# Altium schematic sheet battery_manager_SCH2.SchDoc
size B; Organization: CWRUbotix; Address1: 10900 Euclid Avenue; Address2: Cleveland, OH 44106; Address3: USA
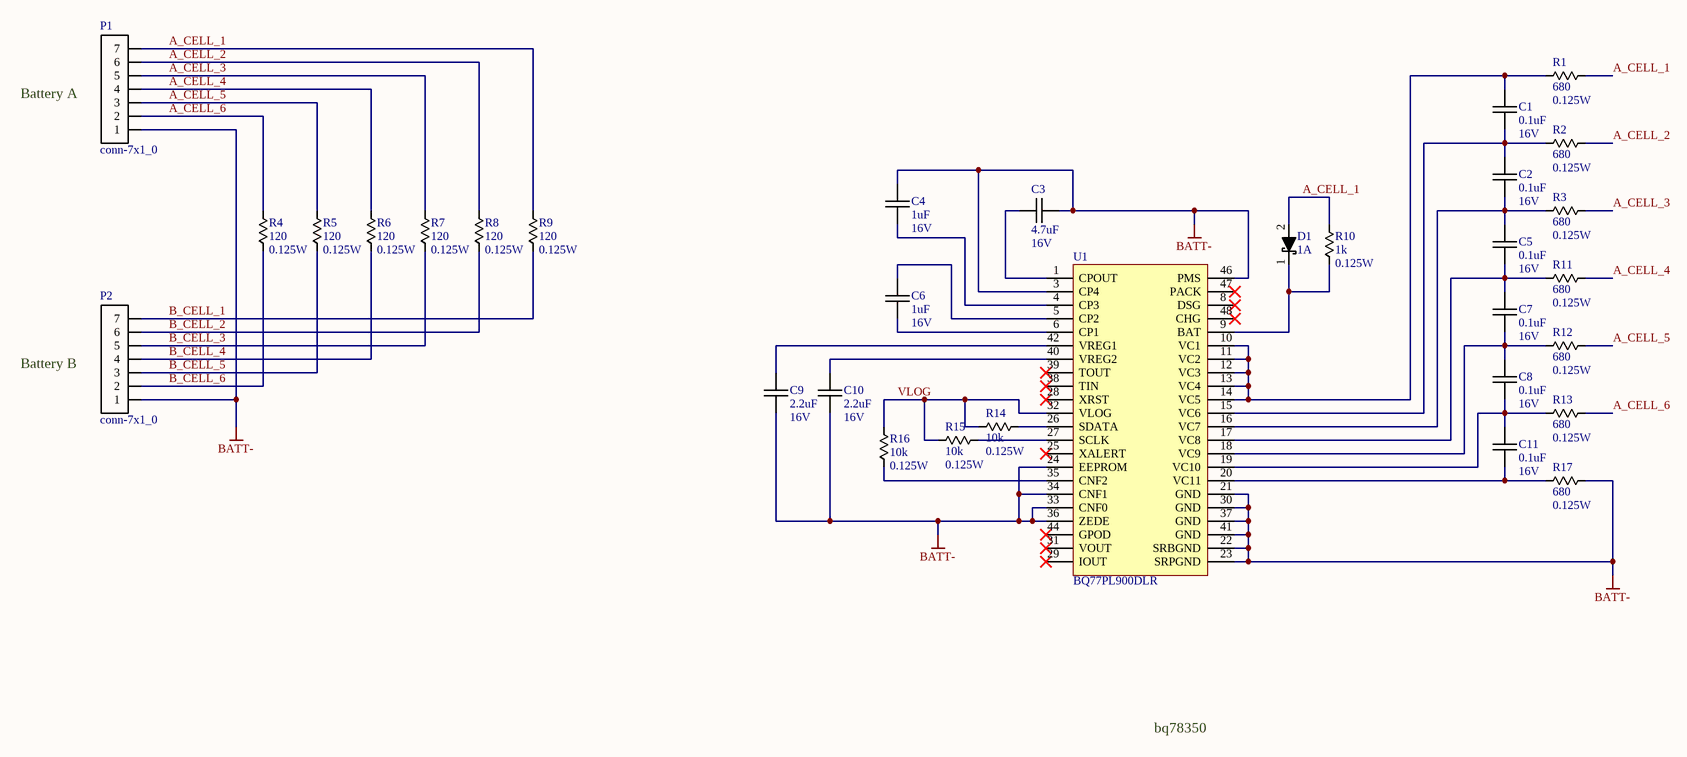
[diagram p0: battery_manager_SCH2.SchDoc]

## Parts
C1  Capacitance: 0.1uF  Voltage Rating: 16V  [chip_0603]  (hidden comment: cap_single_np)
C2  Capacitance: 0.1uF  Voltage Rating: 16V  [chip_0603]  (hidden comment: cap_single_np)
C3  Capacitance: 4.7uF  Voltage Rating: 16V  [chip_0805]  (hidden comment: cap_single_np)
C4  Capacitance: 1uF  Voltage Rating: 16V  [chip_0805]  (hidden comment: cap_single_np)
C5  Capacitance: 0.1uF  Voltage Rating: 16V  [chip_0603]  (hidden comment: cap_single_np)
C6  Capacitance: 1uF  Voltage Rating: 16V  [chip_0805]  (hidden comment: cap_single_np)
C7  Capacitance: 0.1uF  Voltage Rating: 16V  [chip_0603]  (hidden comment: cap_single_np)
C8  Capacitance: 0.1uF  Voltage Rating: 16V  [chip_0603]  (hidden comment: cap_single_np)
C9  Capacitance: 2.2uF  Voltage Rating: 16V  [chip_0805]  (hidden comment: cap_single_np)
C10  Capacitance: 2.2uF  Voltage Rating: 16V  [chip_0805]  (hidden comment: cap_single_np)
C11  Capacitance: 0.1uF  Voltage Rating: 16V  [chip_0603]  (hidden comment: cap_single_np)
D1  Current Rating: 1A  [sod123_0]  (hidden comment: diode_2)
P1  conn-7x1_0  [JST_XH_7_0]
P2  conn-7x1_0  [JST_XH_7_0]
R1  Resistance: 680  Power Rating: 0.125W  [chip_0805]  (hidden comment: res_single)
R2  Resistance: 680  Power Rating: 0.125W  [chip_0805]  (hidden comment: res_single)
R3  Resistance: 680  Power Rating: 0.125W  [chip_0805]  (hidden comment: res_single)
R4  Resistance: 120  Power Rating: 0.125W  [chip_0805]  (hidden comment: res_single)
R5  Resistance: 120  Power Rating: 0.125W  [chip_0805]  (hidden comment: res_single)
R6  Resistance: 120  Power Rating: 0.125W  [chip_0805]  (hidden comment: res_single)
R7  Resistance: 120  Power Rating: 0.125W  [chip_0805]  (hidden comment: res_single)
R8  Resistance: 120  Power Rating: 0.125W  [chip_0805]  (hidden comment: res_single)
R9  Resistance: 120  Power Rating: 0.125W  [chip_0805]  (hidden comment: res_single)
R10  Resistance: 1k  Power Rating: 0.125W  [chip_0805]  (hidden comment: res_single)
R11  Resistance: 680  Power Rating: 0.125W  [chip_0805]  (hidden comment: res_single)
R12  Resistance: 680  Power Rating: 0.125W  [chip_0805]  (hidden comment: res_single)
R13  Resistance: 680  Power Rating: 0.125W  [chip_0805]  (hidden comment: res_single)
R14  Resistance: 10k  Power Rating: 0.125W  [chip_0805]  (hidden comment: res_single)
R15  Resistance: 10k  Power Rating: 0.125W  [chip_0805]  (hidden comment: res_single)
R16  Resistance: 10k  Power Rating: 0.125W  [chip_0805]  (hidden comment: res_single)
R17  Resistance: 680  Power Rating: 0.125W  [chip_0805]  (hidden comment: res_single)
U1  Manufacturer PN: BQ77PL900DLR  [SSOP-48_0]  (hidden comment: BQ77PL900)

## Nets
BATT-: C3.2 C4.1 C9.2 C10.2 P1.1 P2.1 R17.2 U1.3(CP4) U1.21(GND) U1.22(SRBGND) U1.23(SRPGND) U1.24(EEPROM) U1.30(GND) U1.33(CNF0) U1.34(CNF1) U1.36(ZEDE) U1.37(GND) U1.41(GND) U1.46(PMS)
A_CELL_1: D1.2 P1.7 R1.2 R9.1 R10.2
A_CELL_2: P1.6 R2.2 R8.1
A_CELL_3: P1.5 R3.2 R7.1
A_CELL_4: P1.4 R6.1 R11.2
A_CELL_5: P1.3 R5.1 R12.2
A_CELL_6: P1.2 R4.1 R13.2
B_CELL_1: P2.7 R9.2
B_CELL_2: P2.6 R8.2
B_CELL_3: P2.5 R7.2
B_CELL_4: P2.4 R6.2
B_CELL_5: P2.3 R5.2
B_CELL_6: P2.2 R4.2
VLOG: R14.1 R15.1 R16.2 U1.32(VLOG)
NetC1_1: C1.1 R1.1 U1.10(VC1) U1.11(VC2) U1.12(VC3) U1.13(VC4) U1.14(VC5)
NetC1_2: C1.2 C2.1 R2.1 U1.15(VC6)
NetC2_2: C2.2 C5.1 R3.1 U1.16(VC7)
NetC3_1: C3.1 U1.1(CPOUT)
NetC4_2: C4.2 U1.4(CP3)
NetC5_2: C5.2 C7.1 R11.1 U1.17(VC8)
NetC6_1: C6.1 U1.5(CP2)
NetC6_2: C6.2 U1.6(CP1)
NetC7_2: C7.2 C8.1 R12.1 U1.18(VC9)
NetC8_2: C8.2 C11.1 R13.1 U1.19(VC10)
NetC9_1: C9.1 U1.42(VREG1)
NetC10_1: C10.1 U1.40(VREG2)
NetC11_2: C11.2 R17.1 U1.20(VC11)
NetD1_1: D1.1 R10.1 U1.9(BAT)
NetR14_2: R14.2 U1.26(SDATA)
NetR15_2: R15.2 U1.27(SCLK)
NetR16_1: R16.1 U1.35(CNF2)

Not connected (* = marked no-connect by the designer): U1 2(NC) 7(NC) 8(DSG)* 25(XALERT)* 28(XRST)* 29(IOUT)* 31(VOUT)* 38(TIN)* 39(TOUT)* 43(NC) 44(GPOD)* 45(NC) 47(PACK)* 48(CHG)*

## Notes on the sheet
- (near P1) Battery A
- (near P2) Battery B
- bq78350
- Title
- Size:
- B
- Number:
- Revision:
- Date:
- Sheet
- of

## Library data of the parts
C1 C2 C5 C7 C8 C11 = CAP-00542: CAP, 0.1uF, ±10%, 16V, X7R, 0603; Manufacturer: Murata; Tolerance: ±10%; Part Number: CAP-00542; Type: X7R
C3 = CAP-00127: CAP, 4.7uF, 10%, 16V, X7R, 0805; Manufacturer: Murata; Manufacturer PN: GRM21BR71C475KA73L; Tolerance: 10%; Part Number: CAP-00127; Type: X7R
C4 C6 = CAP-00107: CAP, 1uF, 10%, 16V, X7R, 0805; Manufacturer: Murata; Manufacturer PN: GRM21BR71C105KA01L; Tolerance: 10%; Part Number: CAP-00107; Type: X7R
C9 C10 = CAP-00117: CAP, 2.2uF, 10%, 16V, X7R, 0805; Manufacturer: Murata; Manufacturer PN: GRM21BR71C225KA12L; Tolerance: 10%; Part Number: CAP-00117; Type: X7R
D1 = DIO-00001: Dio Shtky, 1A, 0.55V, 40V, SOD-123; Manufacturer: ON Semi; Manufacturer PN: MBR140SFT1G; Forward Voltage: 550mV; Type: Schottky; Reverse Breakdown Voltage: 40V; Part Number: DIO-00001
P1 P2 = CONN-00036: JST XH 7x1, THT; Manufacturer PN: B7B-XH-A; Positions per level: 7; Levels: 1; Current: 3; Part Number: CONN-00036; Type: Thru-hole; Manufacturer: JST
R1-R3 R11-R13 R17 = RES-00250: RES SMD 680 OHM 1% 1/8W 0805; Manufacturer: Rohm Semiconductor; Manufacturer PN: KTR10EZPF6800; Tolerance: 1%; Part Number: RES-00250
R4-R9 = RES-00183: RES SMD 120 OHM 1% 1/8W 0805; Manufacturer: Rohm Semiconductor; Manufacturer PN: KTR10EZPF1200; Tolerance: 1%; Part Number: RES-00183
R10 = RES-00361: RES SMD 1K OHM 1% 1/8W 0805; Manufacturer: Rohm Semiconductor; Manufacturer PN: KTR10EZPF1001; Tolerance: 1%; Part Number: RES-00361
R14-R16 = RES-00307: RES SMD 10K OHM 1% 1/8W 0805; Manufacturer: Rohm Semiconductor; Manufacturer PN: KTR10EZPF1002; Tolerance: 1%; Part Number: RES-00307
U1 = PWREG-00024: Batt Manager, Li-Ion, 5-10 cells, bq77PL900; Manufacturer: TI; Voltage Range In: -0.3 - 60V; Reg Type: Batt Mngr; Fixed/Adj: Fixed; Part Number: PWREG-00024; Cost: 6.36